# EAGLE design Victor 9000 DiskOnChip v2 (EAGLE 9.6.2)
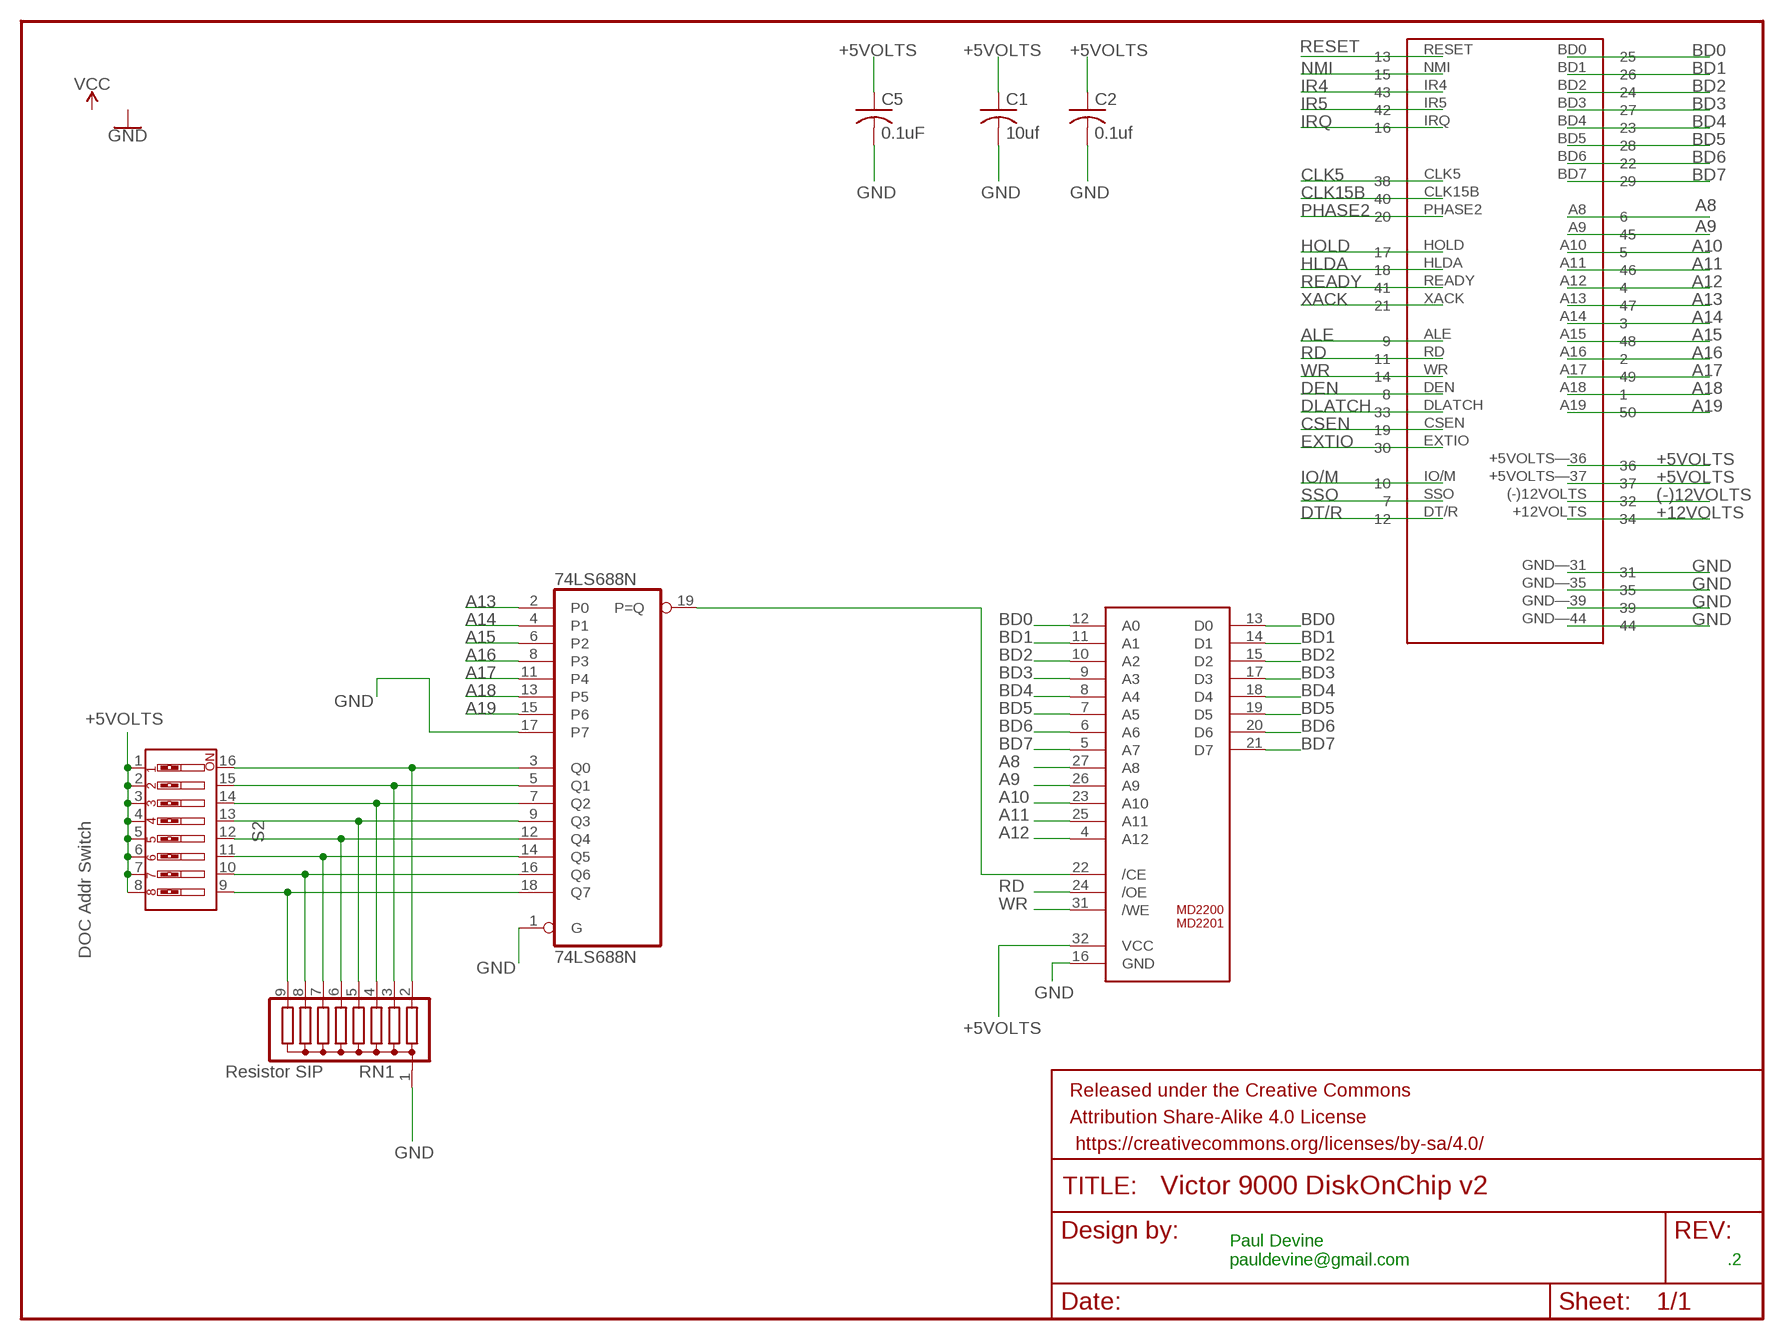
[diagram p0: schematic, sheet 1]

## Parts
74LS688N  74LS688N  [DIL20]
C1  10uf  C-US025-050X050  [C025-050X050]
C2  0.1uf  C-US025-050X050  [C025-050X050]
C5  0.1uF  C-US025-050X050  [C025-050X050]
DISKONCHIP2000  DOC2000  [DIL32]
FRAME1  FRAME-LETTER  [CREATIVE_COMMONS]
RN1  Resistor SIP  G08R  [SIL9]
S2  DOC Addr Switch  DIP-08-PTH  [DIPSWITCH-08]
U$1  VICTOR_GOLD_FINGERS  [VICTOR_GOLD_FINGERS]

## Nets
(-)12VOLTS: U$1.(-)12VOLTS
+5VOLTS: C1.1 C2.1 C5.1 DISKONCHIP2000.32(VCC) S2.1 S2.2 S2.3 S2.4 S2.5 S2.6 S2.7 S2.8 U$1.+5VOLTS—36 U$1.+5VOLTS—37
+12VOLTS: U$1.+12VOLTS
A8: DISKONCHIP2000.27(A8) U$1.A8
A9: DISKONCHIP2000.26(A9) U$1.A9
A10: DISKONCHIP2000.23(A10) U$1.A10
A11: DISKONCHIP2000.25(A11) U$1.A11
A12: DISKONCHIP2000.4(A12) U$1.A12
A13: 74LS688N.2(P0) U$1.A13
A14: 74LS688N.4(P1) U$1.A14
A15: 74LS688N.6(P2) U$1.A15
A16: 74LS688N.8(P3) U$1.A16
A17: 74LS688N.11(P4) U$1.A17
A18: 74LS688N.13(P5) U$1.A18
A19: 74LS688N.15(P6) U$1.A19
ALE: U$1.ALE
BD0: DISKONCHIP2000.12(A0) DISKONCHIP2000.13(D0) U$1.BD0
BD1: DISKONCHIP2000.11(A1) DISKONCHIP2000.14(D1) U$1.BD1
BD2: DISKONCHIP2000.10(A2) DISKONCHIP2000.15(D2) U$1.BD2
BD3: DISKONCHIP2000.9(A3) DISKONCHIP2000.17(D3) U$1.BD3
BD4: DISKONCHIP2000.8(A4) DISKONCHIP2000.18(D4) U$1.BD4
BD5: DISKONCHIP2000.7(A5) DISKONCHIP2000.19(D5) U$1.BD5
BD6: DISKONCHIP2000.6(A6) DISKONCHIP2000.20(D6) U$1.BD6
BD7: DISKONCHIP2000.5(A7) DISKONCHIP2000.21(D7) U$1.BD7
CLK5: U$1.CLK5
CLK15B: U$1.CLK15B
CSEN: U$1.CSEN
DEN: U$1.DEN
DLATCH: U$1.DLATCH
DT/R: U$1.DT/R
EXTIO: U$1.EXTIO
GND: 74LS688N.1(G) 74LS688N.17(P7) C1.2 C2.2 C5.2 DISKONCHIP2000.16(GND) RN1.1 U$1.GND—31 U$1.GND—35 U$1.GND—39 U$1.GND—44
HLDA: U$1.HLDA
HOLD: U$1.HOLD
IO/M: U$1.IO/M
IR4: U$1.IR4
IR5: U$1.IR5
IRQ: U$1.IRQ
N$1: 74LS688N.18(Q7) RN1.9 S2.9
N$2: 74LS688N.16(Q6) RN1.8 S2.10
N$3: 74LS688N.14(Q5) RN1.7 S2.11
N$4: 74LS688N.12(Q4) RN1.6 S2.12
N$5: 74LS688N.9(Q3) RN1.5 S2.13
N$6: 74LS688N.7(Q2) RN1.4 S2.14
N$7: 74LS688N.5(Q1) RN1.3 S2.15
N$8: 74LS688N.3(Q0) RN1.2 S2.16
N$9: 74LS688N.19(P=Q) DISKONCHIP2000.22(/CE)
NMI: U$1.NMI
PHASE2: U$1.PHASE2
RD: DISKONCHIP2000.24(/OE) U$1.RD
READY: U$1.READY
RESET: U$1.RESET
SSO: U$1.SSO
WR: DISKONCHIP2000.31(/WE) U$1.WR
XACK: U$1.XACK

## Notes on the sheet
- MD2200
- Paul Devine
  pauldevine@gmail.com
- .2

## Power pins joined to a net without a drawn wire
GND: 74LS688N.10(GND)
VCC: 74LS688N.20(VCC)

## Library data of the parts
74LS688N = 74xx-us:74*688: 8-bit MAGNITUDE/IDENTITY COMPARATOR, totem pole
C1 C2 C5 = rcl:C-US: CAPACITOR, American symbol; SPICEPREFIX: C
DISKONCHIP2000 = DiskOnChip2000_md2200_md2201:DOC2000
FRAME1 = SparkFun-Aesthetics:FRAME-LETTER: Schematic Frame - Letter Standard 8.5x11 US Letter frame
RN1 = resistor-sil:G08R: SIL RESISTOR; OC_FARNELL: unknown; OC_NEWARK: unknown
S2 = SparkFun-Switches:DIP-08: 8-Position DIP Switch 8-circuit DIP (dual inline package) switch. Commonly used to physcially set a circuit's behavior. SparkFun Products DIP Switch - 8 Position <https://www.sparkfun.com/products/8034> (COM-08034); PROD_ID: SWCH-12197; SF_SKU: COM-08034
U$1 = pauldevine_library:VICTOR_GOLD_FINGERS: Victor 9000 Expansion Board Gold fingers.

## Board
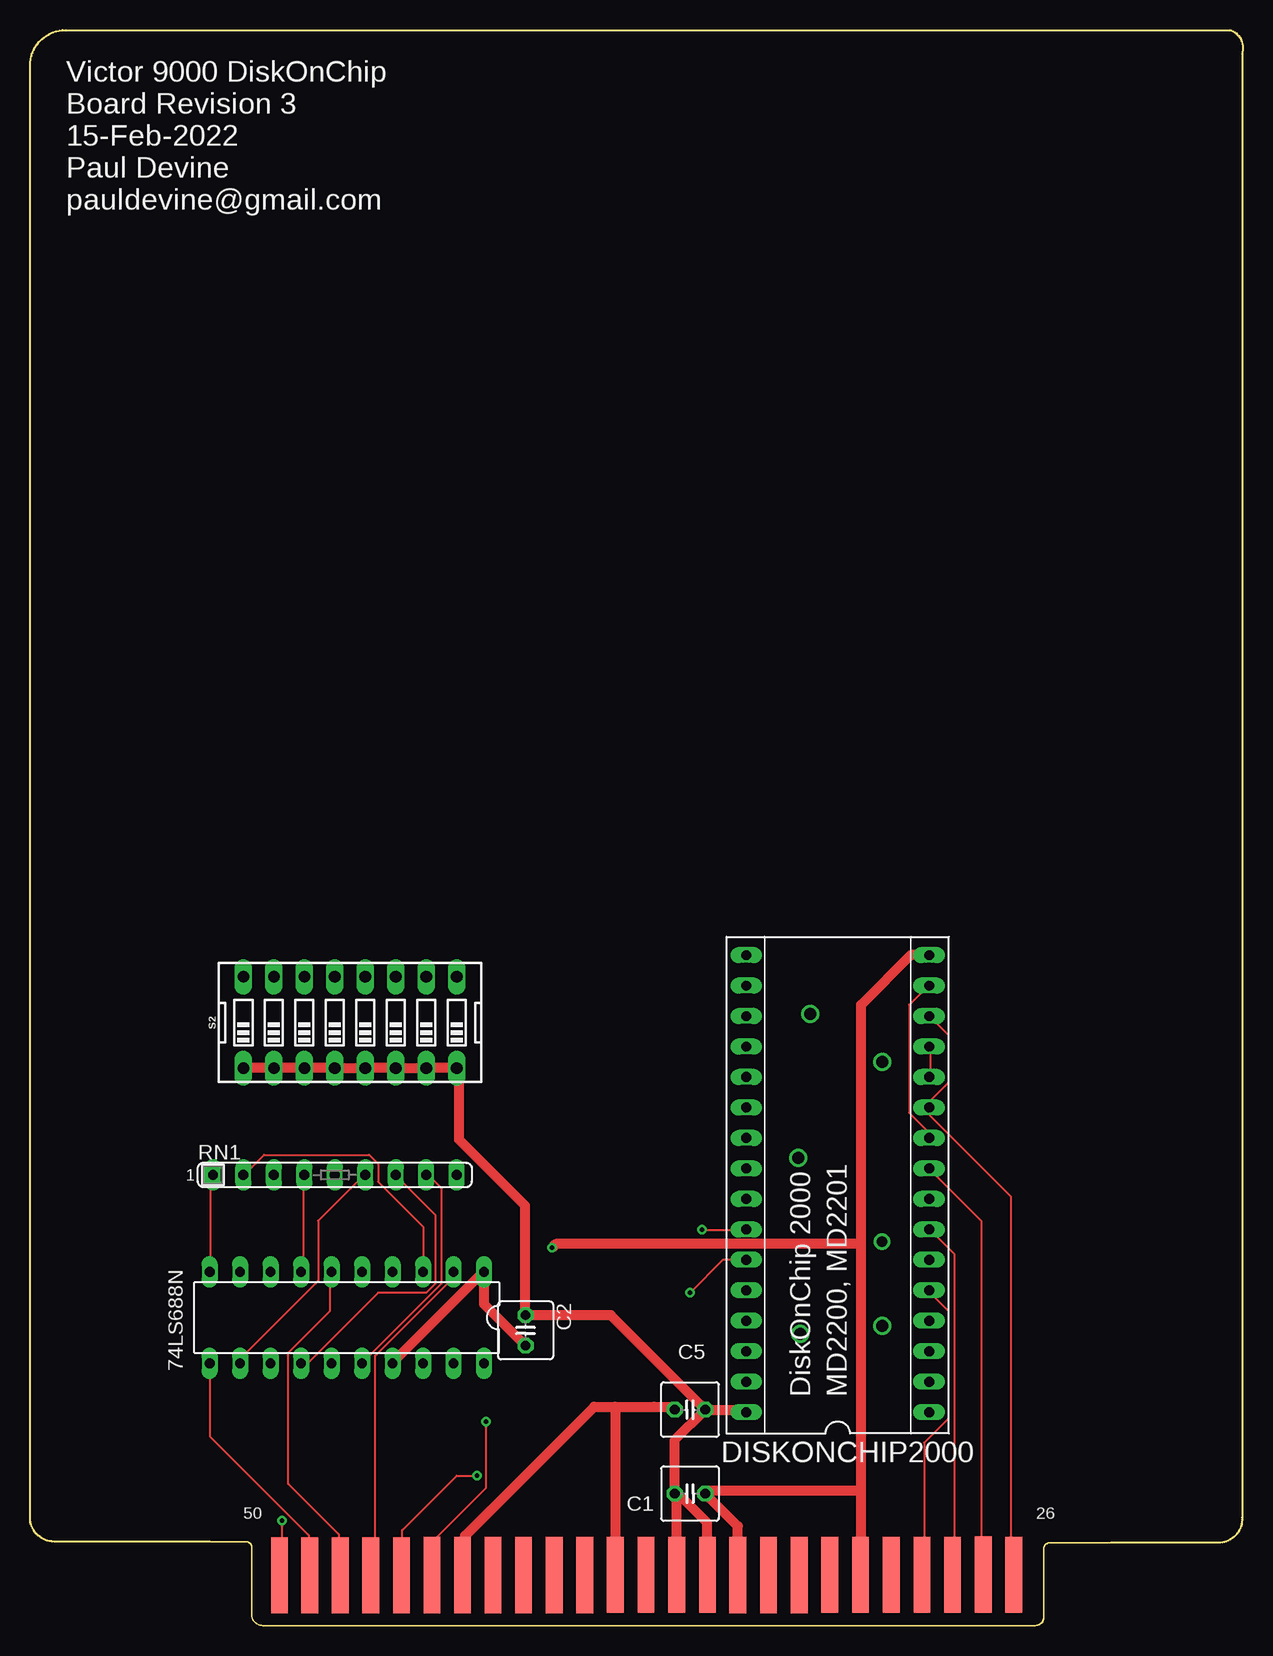
[diagram p1: board, top side]
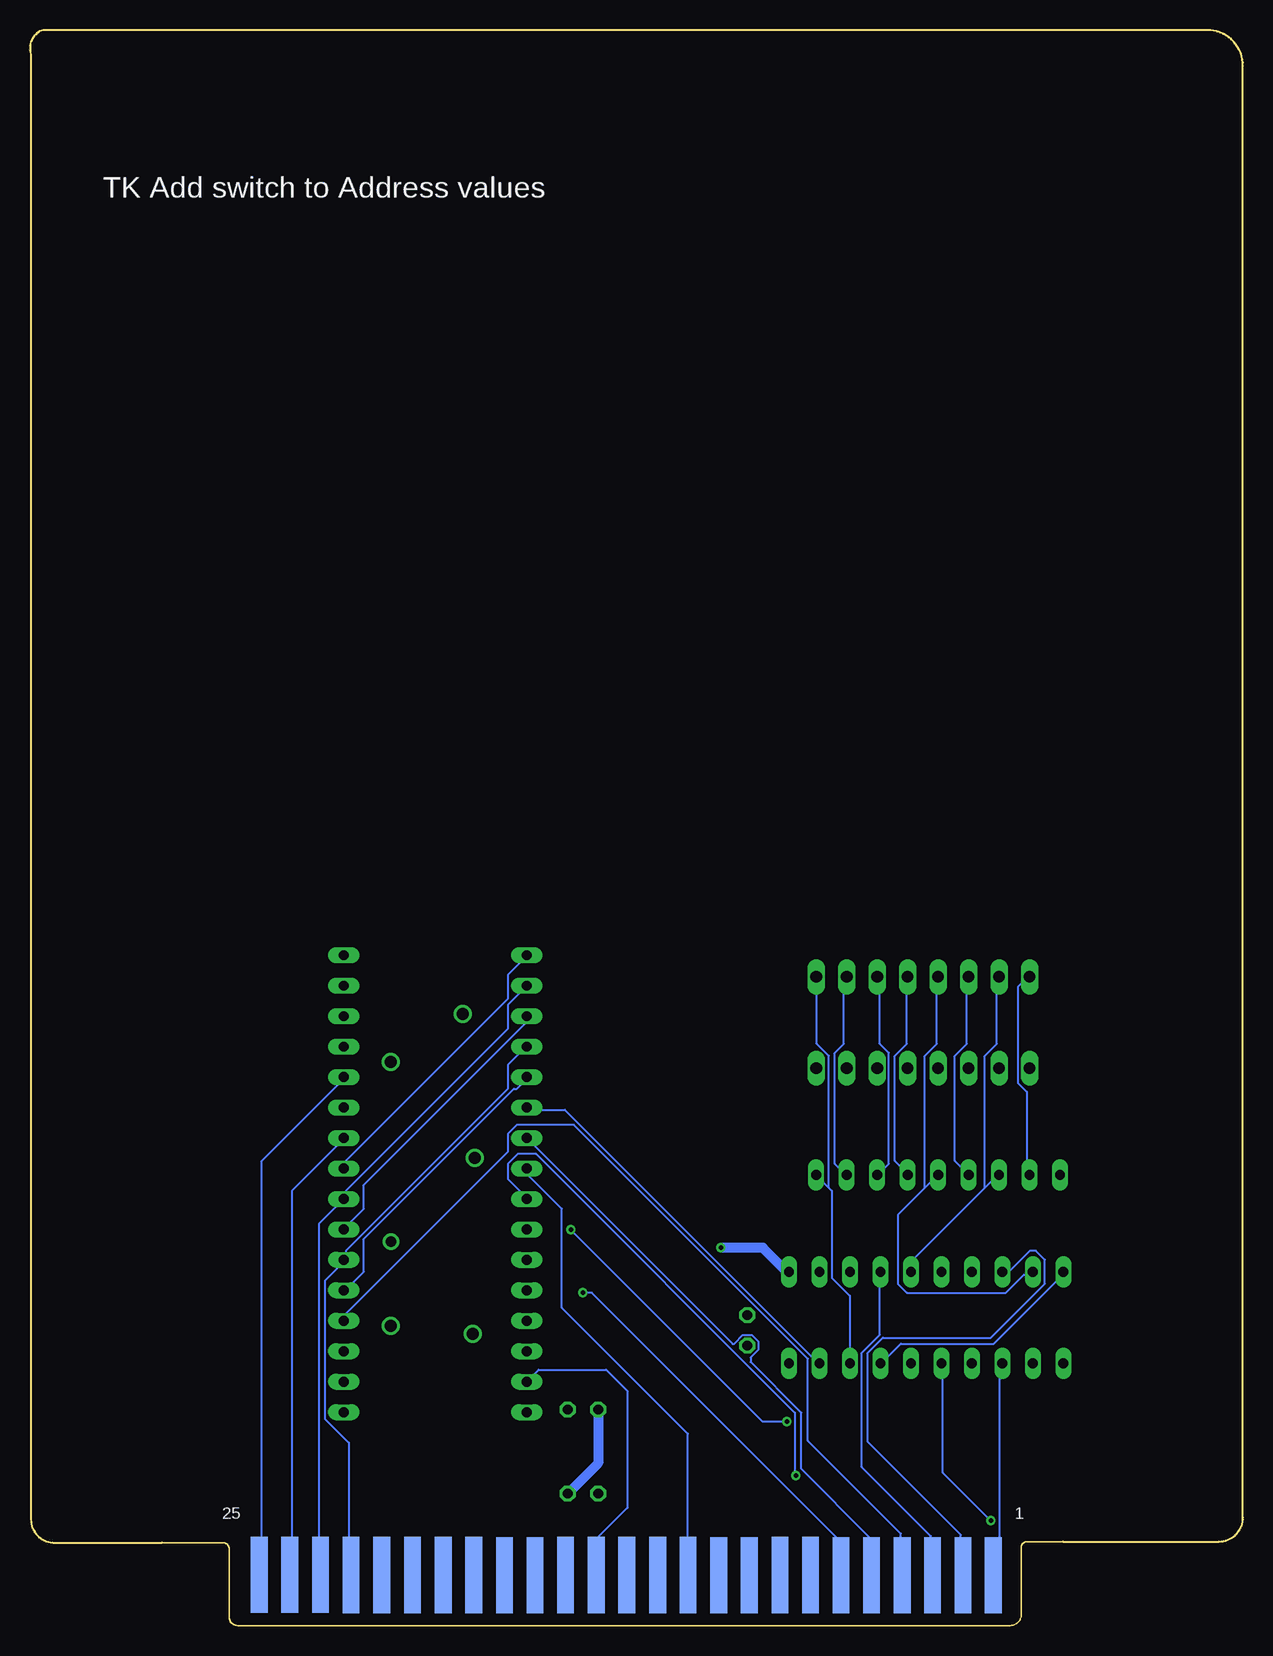
[diagram p2: board, bottom side, seen from below]

Size 101.08 x 133 mm. Coordinates in mm from the lower left corner, seen from the top.
Outline: 15,7 2,7 arc-90 0,9 0,130 arc-90 3,133 100,133 arc-90 101,131 101,9 arc-90 99.2,6.9 90.1,6.9
Copper layers (1*16): Top 0.035mm / dielectric 1.5mm / Bottom 0.035mm
Design rules "default": minimum track width 6mil, minimum drill 0.35mm, track to track 6mil, track to pad 6mil, pad to pad 6mil, via to via 6mil, smd to smd 6mil, copper to edge 40mil, drill to drill 6mil, minimum pad ring 10mil, minimum via ring 8mil, stop-mask expansion 4mil, vias tented up to drill 0mil, thermal gap 10mil

### Footprints (pad centres in the part's own frame; a part is rotated, then mirrored left to right if it is on the bottom)
DIL20 = drill 0.813 long: 1 -11.43,-3.81; 2 -8.89,-3.81; 3 -6.35,-3.81; 4 -3.81,-3.81; 5 -1.27,-3.81; 6 1.27,-3.81; 7 3.81,-3.81; 8 6.35,-3.81; 9 8.89,-3.81; 10 11.43,-3.81; 11 11.43,3.81; 12 8.89,3.81; 13 6.35,3.81; 14 3.81,3.81; 15 1.27,3.81; 16 -1.27,3.81; 17 -3.81,3.81; 18 -6.35,3.81; 19 -8.89,3.81; 20 -11.43,3.81
C025-050X050 = drill 0.813 octagon: 1 -1.27,0; 2 1.27,0
DIL32 = drill 0.813 long: 1 -19.05,-7.62; 2 -16.51,-7.62; 3 -13.97,-7.62; 4 -11.43,-7.62; 5 -8.89,-7.62; 6 -6.35,-7.62; 7 -3.81,-7.62; 8 -1.27,-7.62; 9 1.27,-7.62; 10 3.81,-7.62; 11 6.35,-7.62; 12 8.89,-7.62; 13 11.43,-7.62; 14 13.97,-7.62; 15 16.51,-7.62; 16 19.05,-7.62; 17 19.05,7.62; 18 16.51,7.62; 19 13.97,7.62; 20 11.43,7.62; 21 8.89,7.62; 22 6.35,7.62; 23 3.81,7.62; 24 1.27,7.62; 25 -1.27,7.62; 26 -3.81,7.62; 27 -6.35,7.62; 28 -8.89,7.62; 29 -11.43,7.62; 30 -13.97,7.62; 31 -16.51,7.62; 32 -19.05,7.62
SIL9 = drill 0.813 long: 1 -10.16,0; 2 -7.62,0; 3 -5.08,0; 4 -2.54,0; 5 0,0; 6 2.54,0; 7 5.08,0; 8 7.62,0; 9 10.16,0
DIPSWITCH-08 = drill 0.97 long: 1 -8.89,-3.81; 2 -6.35,-3.81; 3 -3.81,-3.81; 4 -1.27,-3.81; 5 1.27,-3.81; 6 3.81,-3.81; 7 6.35,-3.81; 8 8.89,-3.81; 9 8.89,3.81; 10 6.35,3.81; 11 3.81,3.81; 12 1.27,3.81; 13 -1.27,3.81; 14 -3.81,3.81; 15 -6.35,3.81; 16 -8.89,3.81
VICTOR_GOLD_FINGERS = smd 1.4 x 6.35: (-)12VOLTS 36.172,4.217; +5VOLTS—36 25.974,4.217; +5VOLTS—37 23.428,4.218; +12VOLTS 31.056,4.207; A9 3.012,4.207; A11 0.477,4.194; A13 -2.081,4.195; A15 -4.615,4.195; A17 -7.162,4.192; A19 -9.682,4.177; BD1 51.491,4.224; BD3 48.947,4.245; BD5 46.392,4.233; BD7 43.855,4.22; CLK5 20.861,4.218; CLK15B 15.755,4.207; DLATCH 33.612,4.207; EXTIO 41.297,4.22; GND—31 38.727,4.221; GND—35 28.509,4.207; GND—39 18.301,4.217; GND—44 5.558,4.207; IR4 8.103,4.207; IR5 10.652,4.207; READY 13.209,4.207 | smd 1.4 x 6.35 bottom: A8 3.01,4.195; A10 0.467,4.191; A12 -2.077,4.194; A14 -4.614,4.194; A16 -7.155,4.191; A18 -9.681,4.182; ALE 10.655,4.2; BD0 51.505,4.224; BD2 48.955,4.241; BD4 46.399,4.224; BD6 43.85,4.212; CSEN 36.169,4.211; DEN 8.102,4.203; DT/R 18.298,4.211; HLDA 33.615,4.206; HOLD 31.058,4.2; IO/M 13.208,4.2; IRQ 28.514,4.2; NMI 25.971,4.215; PHASE2 38.729,4.212; RD 15.761,4.207; RESET 20.865,4.211; SSO 5.552,4.207; WR 23.418,4.211; XACK 41.29,4.212

### Placement (x,y rotation side)
74LS688N  26.4,25.67 180 top
C1  55,11 0 top
C2  41.3,24.6 270 top
C5  55,18 180 top
DISKONCHIP2000  67.31,36.83 90 top
FRAME1  -80.01,52.07 0 top  (outside the outline)
RN1  25.4,37.56 0 top
S2  26.67,50.26 0 top
U$1  30.48,0 0 top

### Tracks (layer width: path | path; a pad name or v marks a point on that pad's centre or on a via)
+5VOLTS
  Top 0.152: 33.25,46.5 S2.7 33,46.5 | 35.5,46.5 S2.8 35.75,46.25 | 28,46.5 S2.5 27.75,46.5 | 30.25,46.5 S2.6 30.5,46.5 | 18,46.5 S2.1 | 20.25,46.5 S2.2 20.5,46.5 | 23,46.5 S2.3 22.75,46.5 | 25.25,46.5 S2.4 25.5,46.5 | 56.25,4.25 U$1.+5VOLTS—36 56.4,4.27 | 54,4.25 U$1.+5VOLTS—37 | 59.47,18 DISKONCHIP2000.32 | C2.1 41.25,25.92 | 53.91,10.82 C1.1 54,11
  Top 0.813: 35.5,46.5 33.25,46.5 | 30.25,46.5 28,46.5 | 20.25,46.5 18,46.5 | 25.25,46.5 23,46.5 | 22.75,46.5 20.5,46.5 | 25.5,46.5 27.75,46.5 | 30.5,46.5 33,46.5 | 35.75,46.25 35.75,40.5 41.25,35 41.25,25.92 | C1.1 53.73,15.46 C5.1 | C5.1 59.47,18 | C5.1 48.4,25.87 C2.1 | U$1.+5VOLTS—37 53.91,10.82 | 56.4,4.27 56.4,8.6 54,11
A8  (via drill 0.35)
  Top 0.152: DISKONCHIP2000.27 57.73,30.48 v55,27.75
  Bottom 0.152: v55,27.75 54.25,27.75 33.5,7 33.5,4.25 U$1.A8
A9  (via drill 0.35)
  Top 0.152: v56,33 59.5,33 DISKONCHIP2000.26 | v38,17 38,11.5 33.5,7 33.5,4.25 U$1.A9
  Bottom 0.152: v38,17 40,17 v56,33
A10
  Bottom 0.152: DISKONCHIP2000.23 42.52,23.48 42.41,23.48 41.67,24.22 40.93,24.22 40.41,23.7 40.41,22.96 41.02,22.35 41.02,21.98 36.8,17.75 36.8,13.05 31,7.25 31,4.25 U$1.A10
A11  (via drill 0.35)
  Top 0.152: v37.25,12.5 35.55,12.5 31,7.95 31,4.25 U$1.A11
  Bottom 0.152: v37.25,12.5 37.35,12.6 37.35,17.75 58.9,39.3 60.45,39.3 61.25,38.5 61.25,37.25 59.75,35.75 DISKONCHIP2000.25
A12
  Bottom 0.152: DISKONCHIP2000.4 74.75,25.5 74.75,26 61.25,39.5 61.25,41 60.5,41.75 55.75,41.75 36.25,22.25 36.25,15.4 28.5,7.65 28.5,4.25 U$1.A12
A13
  Top 0.152: 74LS688N.2 35.25,29.25 34.75,28.75 34.75,28.5 28.75,22.5 28.75,4.5 28.5,4.25 U$1.A13
A14
  Bottom 0.152: 74LS688N.4 30.25,29.25 30.25,24.25 31.75,22.75 31.75,13.2 26,7.45 26,4.25 U$1.A14
A15
  Top 0.152: 74LS688N.6 25,29.25 25,26.25 21.5,22.75 21.5,11.8 25.75,7.55 25.75,4.25 U$1.A15
A16
  Bottom 0.152: 74LS688N.8 20,29.5 19.5,29.5 17.75,31.25 17.25,31.25 16.5,30.5 16.5,28.5 21,24 30,24 31.25,22.75 31.25,15.3 23.5,7.55 23.5,4.25 U$1.A16
A17
  Top 0.152: 74LS688N.11 15,21.75 15,15.75 23.25,7.5 23.25,4.25 U$1.A17
A18
  Bottom 0.152: 74LS688N.13 20.25,21.75 20.25,4.75 20.75,4.25 U$1.A18
A19  (via drill 0.35)
  Top 0.152: v21,8.75 21,4.25 U$1.A19
  Bottom 0.152: v21,8.75 25,12.75 25,21.75 74LS688N.15
BD0
  Top 0.152: DISKONCHIP2000.12 75,45.75 75,48.25 DISKONCHIP2000.13
  Bottom 0.152: DISKONCHIP2000.12 75,45.5 81.75,38.75 81.75,4.25 U$1.BD0
BD1
  Top 0.152: DISKONCHIP2000.14 75,50.75 76.5,49.25 76.5,45.25 75,43.75 75,43.25 DISKONCHIP2000.11 75,43 75,42.5 81.75,35.75 81.75,4.25 U$1.BD1
BD2
  Top 0.152: DISKONCHIP2000.10 74.75,40.75 74.75,41.25 73.25,42.75 73.25,51.75 74.75,53.25 DISKONCHIP2000.15
  Bottom 0.152: U$1.BD2 79.25,4.25 79.25,36.25 75,40.5 DISKONCHIP2000.10
BD3
  Top 0.152: U$1.BD3 79.25,4.25 79.25,33.75 75,38 DISKONCHIP2000.9
  Bottom 0.152: DISKONCHIP2000.9 74.75,38.25 74.75,38.75 61.25,52.25 61.25,54.25 59.75,55.75 DISKONCHIP2000.17
BD4
  Bottom 0.152: DISKONCHIP2000.18 59.75,53.25 61.25,51.75 61.25,49.75 74.75,36.25 74.75,35.75 DISKONCHIP2000.8 75,35.5 77,33.5 77,4.25 U$1.BD4
BD5
  Top 0.152: U$1.BD5 77,4.25 77,31 75,33 DISKONCHIP2000.7
  Bottom 0.152: DISKONCHIP2000.19 59.75,50.75 59.75,50.25 73.25,36.75 73.25,34.75 74.75,33.25 DISKONCHIP2000.7
BD6
  Bottom 0.152: DISKONCHIP2000.20 59.75,48.25 61.25,46.75 61.25,44.75 74.75,31.25 74.75,30.5 DISKONCHIP2000.6 75,30.25 76.5,28.75 76.5,17.25 74.5,15.25 74.5,4.25 U$1.BD6
BD7
  Top 0.152: U$1.BD7 74.5,4.25 74.5,15.25 76.5,17.25 76.5,26.25 75,27.75 DISKONCHIP2000.5
  Bottom 0.152: DISKONCHIP2000.21 59.75,45.5 60.5,44.75 60.75,44.75 73.25,32.25 73.25,29.5 74.75,28 DISKONCHIP2000.5
GND  (via drill 0.35)
  Top 0.152: 59,4.25 U$1.GND—35 | 69.25,4.25 U$1.GND—31 | 74LS688N.10 15,29.5 15,37.5 RN1.1 | 38,29.25 74LS688N.1 37.75,29.5 | 30.25,22 74LS688N.17 | 36.25,4.25 U$1.GND—44 | 48.75,4.25 U$1.GND—39 | C1.2 56.52,11.25 | C5.2 52.25,18 52,18.25
  Top 0.813: DISKONCHIP2000.16 73.38,55.88 69.25,51.75 69.25,31.8 | 69.25,4.25 69.25,11.25 | 69.25,11.25 69.25,31.8 | 48.75,18.25 47,18.25 36.25,7.5 36.25,4.25 | 48.75,18.25 52,18.25 53.75,18.25 | 37.75,29.5 30.25,22 | 48.75,18.25 48.75,4.25 | v43.5,31.5 43.8,31.8 69.25,31.8 | 69.25,11.25 56.52,11.25 | 74LS688N.1 37.83,26.8 C2.2 | U$1.GND—35 58.99,8.28 C1.2
  Bottom 0.152: 74LS688N.10 15,29.25 20.75,23.5 28.5,23.5 30,22 74LS688N.17 | 38,29.5 74LS688N.1
  Bottom 0.813: v43.5,31.5 40,31.5 38,29.5 | C1.2 53.73,13.54 C5.2
N$1
  Bottom 0.152: 74LS688N.18 32.75,27.5 34.25,29 34.25,36.25 34.5,36.5 | RN1.9 34.5,36.5 | 34.5,36.5 34.5,47.5 35.5,48.5 35.5,54 S2.9
N$2
  Top 0.152: 74LS688N.16 27.75,22 34.25,28.5 34.25,36.5 33.25,37.5 RN1.8
  Bottom 0.152: S2.10 33.25,54 33.25,48.5 34,47.75 34,38.5 33.25,37.75 RN1.8
N$3
  Top 0.152: 74LS688N.14 22.75,22 23.25,22 29,27.75 33,27.75 33.75,28.5 33.75,34.25 30.5,37.5 RN1.7
  Bottom 0.152: S2.11 30.25,54 30.25,48.5 29.5,47.75 29.5,38.5 30.25,37.75 RN1.7
N$4
  Top 0.152: 74LS688N.12 17.75,22 17.75,22.5 24,28.75 24,33.75 27.75,37.5 RN1.6
  Bottom 0.152: S2.12 28,54 28,48.5 29,47.5 29,38.75 28,37.75 RN1.6
N$5
  Bottom 0.152: 26.5,36.5 25.5,37.5 RN1.5 | 26.5,36.5 28.75,34.25 28.75,28.5 28,27.75 19.75,27.75 18.25,29.25 17.75,29.25 74LS688N.9 | 26.5,36.5 26.5,47.5 25.5,48.5 25.5,54 S2.13
N$6
  Top 0.152: 74LS688N.7 22.75,29.5 22.75,37.5 RN1.4
  Bottom 0.152: S2.14 23,54 23,48.5 24,47.5 24,38.75 23,37.75 RN1.4
N$7
  Bottom 0.152: 21.5,36.5 20.5,37.5 RN1.3 | 21.5,36.5 27.5,30.5 27.5,29.5 74LS688N.5 | 21.5,36.5 21.5,47.5 20.5,48.5 20.5,54 S2.15
N$8
  Top 0.152: 74LS688N.3 32.75,33.25 29,37 29,38.5 28.25,39.25 19.5,39.25 18,37.75 RN1.2
  Bottom 0.152: RN1.2 18,37.75 18,44.5 18.75,45.25 18.75,53.25 18,54 S2.16
N$9
  Bottom 0.152: 74LS688N.19 35.5,22 56.5,43 59.5,43 DISKONCHIP2000.22
N$10  (via drill 1)
  other vias: 71,25
N$11  (via drill 1)
  other vias: 71,47
N$12  (via drill 0.9)
  other vias: 71,32
N$13  (via drill 1)
  other vias: 64,39
N$14  (via drill 1)
  other vias: 65,51
N$15  (via drill 1)
  other vias: 64.2,24.3
RD
  Bottom 0.152: DISKONCHIP2000.24 59.5,38 59.5,37.5 56.75,34.75 56.75,26.5 46.25,16 46.25,4.25 U$1.RD
WR
  Bottom 0.152: DISKONCHIP2000.31 58.69,21.32 53.07,21.32 51.3,19.55 51.3,9.81 53.9,7.21 U$1.WR

### Text on the board
tPlace: Victor 9000 DiskOnChip / Board Revision 3 / 15-Feb-2022 / Paul Devine / pauldevine@gmail.com
bPlace: TK Add switch to Address values